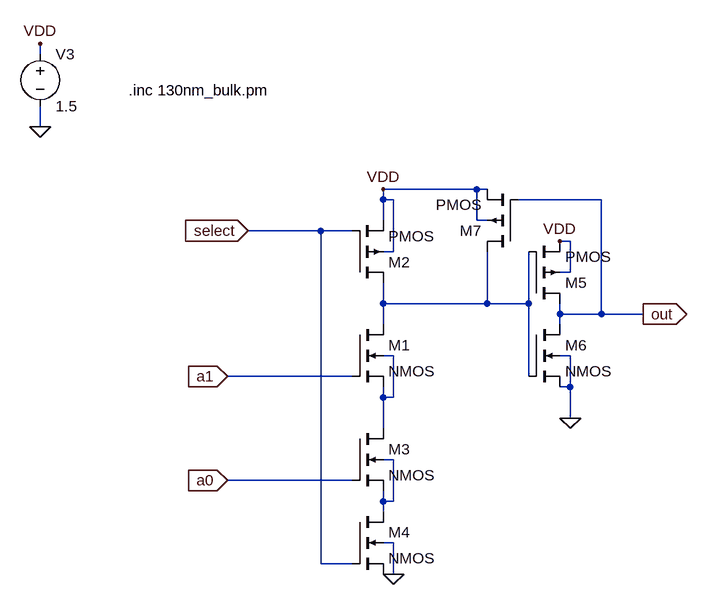
[diagram p0: schematic charge_decoder.asc]
charge_decoder.asc, the LTspice schematic file:
Version 4
SHEET 1 928 680
WIRE -96 -400 -96 -416
WIRE -96 -288 -96 -320
WIRE 576 -192 432 -192
WIRE 592 -192 576 -192
WIRE 432 -176 432 -192
WIRE 448 -176 432 -176
WIRE 768 -176 640 -176
WIRE 432 -144 432 -176
WIRE 576 -144 576 -192
WIRE 592 -144 576 -144
WIRE 336 -128 224 -128
WIRE 384 -128 336 -128
WIRE 720 -112 704 -112
WIRE 448 -96 448 -176
WIRE 448 -96 432 -96
WIRE 720 -64 720 -112
WIRE 720 -64 704 -64
WIRE 432 -16 432 -48
WIRE 592 -16 592 -96
WIRE 592 -16 432 -16
WIRE 656 -16 656 -96
WIRE 656 -16 592 -16
WIRE 704 0 704 -16
WIRE 768 0 768 -176
WIRE 768 0 704 0
WIRE 832 0 768 0
WIRE 432 16 432 -16
WIRE 704 16 704 0
WIRE 448 64 432 64
WIRE 720 64 704 64
WIRE 384 96 192 96
WIRE 656 96 656 -16
WIRE 720 112 720 64
WIRE 720 112 704 112
WIRE 432 128 432 112
WIRE 448 128 448 64
WIRE 448 128 432 128
WIRE 720 160 720 112
WIRE 432 176 432 128
WIRE 448 224 432 224
WIRE 384 256 192 256
WIRE 432 288 432 272
WIRE 448 288 448 224
WIRE 448 288 432 288
WIRE 432 304 432 288
WIRE 448 352 432 352
WIRE 336 384 336 -128
WIRE 384 384 336 384
WIRE 448 400 448 352
WIRE 448 400 432 400
FLAG 448 400 0
FLAG 432 -192 VDD
FLAG 720 160 0
FLAG -96 -288 0
FLAG -96 -416 VDD
FLAG 704 -112 VDD
FLAG 192 96 a1
IOPIN 192 96 In
FLAG 192 256 a0
IOPIN 192 256 In
FLAG 224 -128 select
IOPIN 224 -128 In
FLAG 832 0 out
IOPIN 832 0 Out
SYMBOL nmos4 384 16 R0
SYMATTR InstName M1
SYMATTR Value2 l=130e-9 w=1300e-9 ad=676000e-18 as=676000e-18 pd=3640e-9 ps=3640e-9
SYMBOL pmos4 384 -48 M180
SYMATTR InstName M2
SYMATTR Value2 l=130e-9 w=2600e-9 ad=676000e-18 as=676000e-18 pd=3640e-9 ps=3640e-9
SYMBOL nmos4 384 176 R0
SYMATTR InstName M3
SYMATTR Value2 l=130e-9 w=1300e-9 ad=676000e-18 as=676000e-18 pd=3640e-9 ps=3640e-9
SYMBOL nmos4 384 304 R0
SYMATTR InstName M4
SYMATTR Value2 l=130e-9 w=1300e-9 ad=676000e-18 as=676000e-18 pd=3640e-9 ps=3640e-9
SYMBOL pmos4 656 -16 M180
SYMATTR InstName M5
SYMATTR Value2 l=130e-9 w=2600e-9 ad=676000e-18 as=676000e-18 pd=3640e-9 ps=3640e-9
SYMBOL nmos4 656 16 R0
SYMATTR InstName M6
SYMATTR Value2 l=130e-9 w=1300e-9 ad=676000e-18 as=676000e-18 pd=3640e-9 ps=3640e-9
SYMBOL pmos4 640 -96 R180
SYMATTR InstName M7
SYMATTR Value2 l=260e-9 w=2600e-9 ad=676000e-18 as=676000e-18 pd=3640e-9 ps=3640e-9
SYMBOL voltage -96 -416 R0
WINDOW 123 0 0 Left 0
WINDOW 39 0 0 Left 0
SYMATTR InstName V3
SYMATTR Value 1.5
TEXT 40 -344 Left 2 !.inc 130nm_bulk.pm

The netlist it stands for:
* charge_decoder.asc
M1 N001 a1 N002 N002 NMOS l=130e-9 w=1300e-9 ad=676000e-18 as=676000e-18 pd=3640e-9 ps=3640e-9
M2 N001 select VDD VDD PMOS l=130e-9 w=2600e-9 ad=676000e-18 as=676000e-18 pd=3640e-9 ps=3640e-9
M3 N002 a0 N003 N003 NMOS l=130e-9 w=1300e-9 ad=676000e-18 as=676000e-18 pd=3640e-9 ps=3640e-9
M4 N003 select 0 0 NMOS l=130e-9 w=1300e-9 ad=676000e-18 as=676000e-18 pd=3640e-9 ps=3640e-9
M5 out N001 VDD VDD PMOS l=130e-9 w=2600e-9 ad=676000e-18 as=676000e-18 pd=3640e-9 ps=3640e-9
M6 out N001 0 0 NMOS l=130e-9 w=1300e-9 ad=676000e-18 as=676000e-18 pd=3640e-9 ps=3640e-9
M7 N001 out VDD VDD PMOS l=260e-9 w=2600e-9 ad=676000e-18 as=676000e-18 pd=3640e-9 ps=3640e-9
V3 VDD 0 1.5
.model NMOS NMOS
.model PMOS PMOS
.lib standard.mos
.inc 130nm_bulk.pm
.backanno
.end